# Altium schematic sheet Top.SchDoc: Top
size A4; Date: Not used; ApprovedBy: Not used; CheckedBy: Not used; Author: Not used; CompanyName: STMicroelectronics; DrawnBy: Not used; Engineer: Not used; Organization: Not used; Address1: Not used; Address2: Not used; Address3: Not used; Address4: Not used; DocumentNumber: Not used; Revision: Not used; SheetNumber: 2; SheetTotal: 2; CurrentTime: Not used; CurrentDate: Not used; Time: Not used; DocumentFullPathAndName: Not used; DocumentName: Not used; ModifiedDate: Not used; ImagePath: Not used; ProjectName: Not used; Application_BuildNumber: Not used
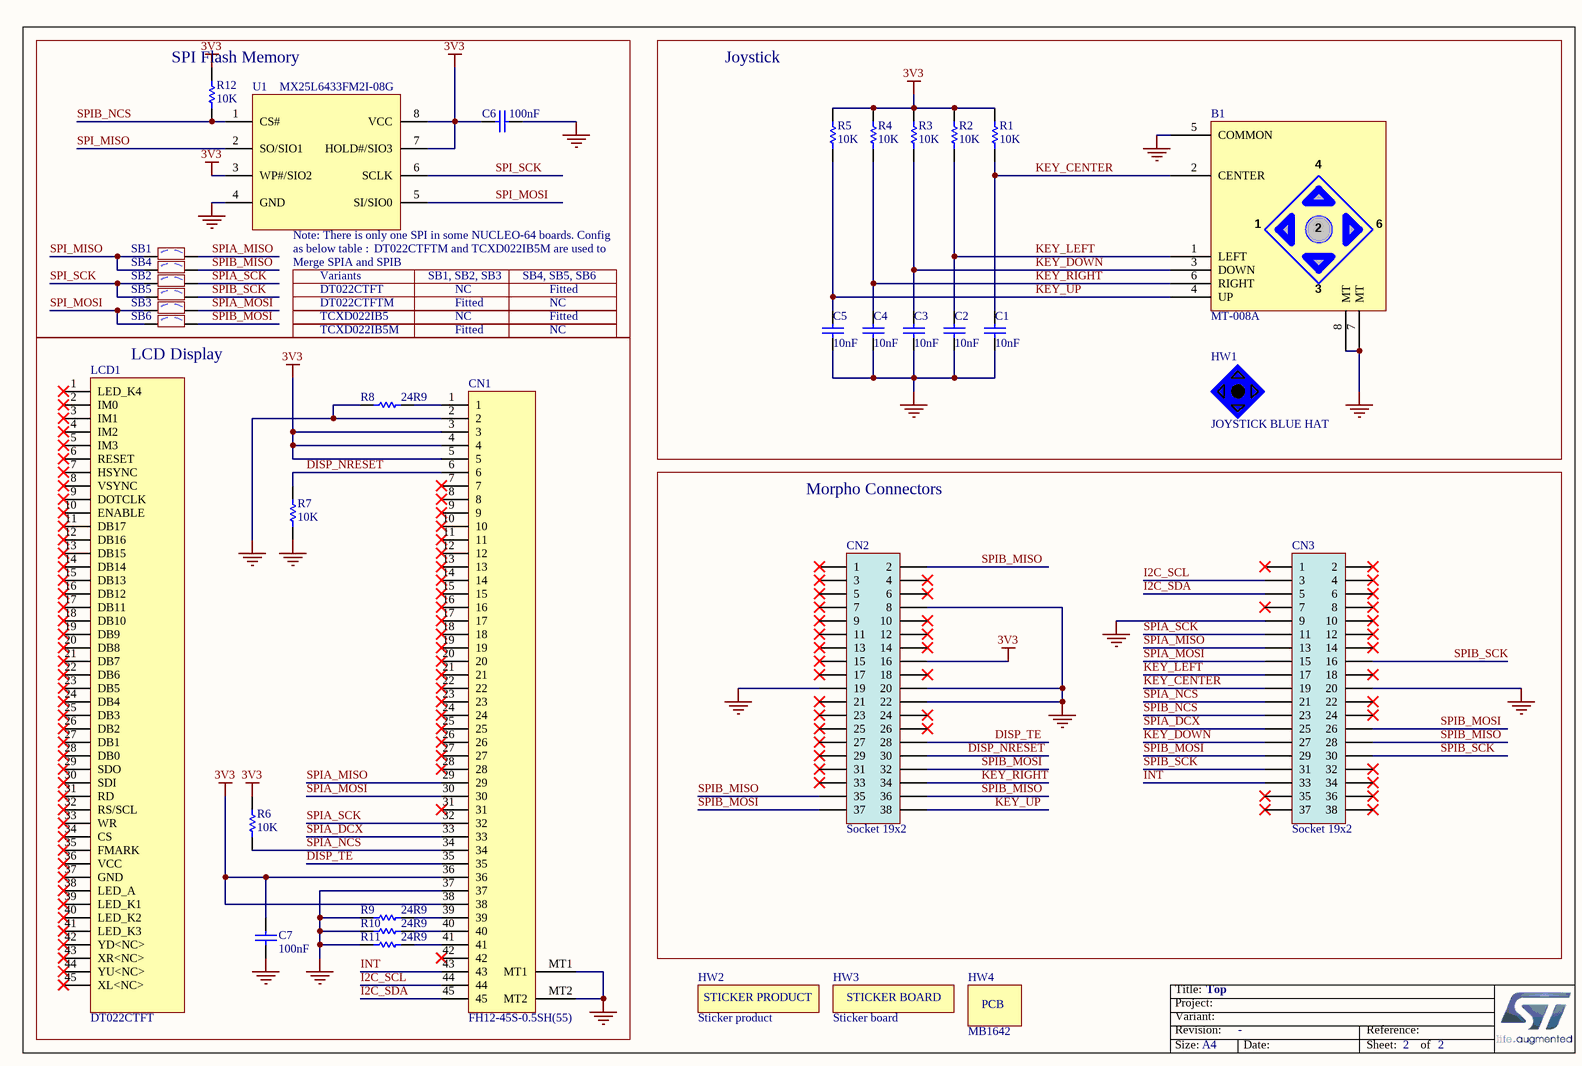
[diagram p0: Top.SchDoc]

## Parts
B1  value MT-008A  [SWI_XIEJIA_MT-008A_6P]  (hidden comment: Joystick MT-008A_M)
C1  value 10nF  [C0603]  (hidden comment: Capacitor)
C2  value 10nF  [C0603]  (hidden comment: Capacitor)
C3  value 10nF  [C0603]  (hidden comment: Capacitor)
C4  value 10nF  [C0603]  (hidden comment: Capacitor)
C5  value 10nF  [C0603]  (hidden comment: Capacitor)
C6  value 100nF  [C0603]  (hidden comment: Capacitor)
C7  value 100nF  [C0603]  (hidden comment: Capacitor)
CN1  FH12-45S-0.5SH(55)  [CON_HRS_FH12-45S-05SH]
CN2  Socket 19x2  [CON_SAMTEC_SSW-119-01-X-D]
CN3  Socket 19x2  [CON_SAMTEC_SSW-119-01-X-D]
HW1  value JOYSTICK BLUE HAT  (hidden comment: JOYSTICK_BLUE_HAT)  (mechanical)
HW2  value Sticker product  [STICKER_PRODUCT_25X5]  (hidden comment: STICKER_PRODUCT)  (no BOM)
HW3  value Sticker board  [STICKER_BOARD_25X5]  (hidden comment: STICKER_BOARD)  (no BOM)
HW4  value MB1642  (hidden comment: PCB)  (no BOM)
LCD1  DT022CTFT  [LCD_DISPLAYTECH_DT022CTFT_45P_P050]
R1  value 10K  [R0603]  (hidden comment: Resistor)
R2  value 10K  [R0603]  (hidden comment: Resistor)
R3  value 10K  [R0603]  (hidden comment: Resistor)
R4  value 10K  [R0603]  (hidden comment: Resistor)
R5  value 10K  [R0603]  (hidden comment: Resistor)
R6  value 10K  [R0603]  (hidden comment: Resistor)
R7  value 10K  [R0603]  (hidden comment: Resistor)
R8  value 24R9  [R1206_H0P55]  (hidden comment: Resistor)
R9  value 24R9  [R1206_H0P55]  (hidden comment: Resistor)
R10  value 24R9  [R1206_H0P55]  (hidden comment: Resistor)
R11  value 24R9  [R1206_H0P55]  (hidden comment: Resistor)
R12  value 10K  [R0603]  (hidden comment: Resistor)
SB1  SB_OFF  [SOLDER-BRIDGE_R0603-0R]  (value not drawn)
SB2  SB_OFF  [SOLDER-BRIDGE_R0603-0R]  (value not drawn)
SB3  SB_OFF  [SOLDER-BRIDGE_R0603-0R]  (value not drawn)
SB4  SB_OFF  [SOLDER-BRIDGE_R0603-0R]  (value not drawn)
SB5  SB_OFF  [SOLDER-BRIDGE_R0603-0R]  (value not drawn)
SB6  SB_OFF  [SOLDER-BRIDGE_R0603-0R]  (value not drawn)
U1  MX25L6433FM2I-08G  [ICC_SOP8_5P23X5P28_P127]

## Blocks framed on the sheet
SPI Flash Memory: C6 R12 SB1-SB6 U1
Joystick: B1 C1-C5 HW1 R1-R5
LCD Display: C7 CN1 LCD1 R6-R11
Morpho Connectors: CN2 CN3

## Nets
3V3: C6.1 C7.2 CN1.3 CN1.4 CN1.5 CN1.36 CN1.38 CN2.16 R1.1 R2.2 R3.2 R4.2 R5.2 R6.2 R12.1 U1.3(WP#/SIO2) U1.7(HOLD#/SIO3) U1.8(VCC)
GND: B1.5(COMMON) B1.7(MT) B1.8(MT) C1.1 C2.1 C3.1 C4.1 C5.1 C6.2 C7.1 CN1.2 CN1.37 CN1.MT1 CN1.MT2 CN2.8 CN2.19 CN2.20 CN2.22 CN3.9 CN3.20 R7.1 R8.1 R9.1 R10.1 R11.1 U1.4(GND)
DISP_NRESET: CN1.6 CN2.30 R7.2
DISP_TE: CN1.35 CN2.28
I2C_SCL: CN1.44 CN3.3
I2C_SDA: CN1.45 CN3.5
INT: CN1.43 CN3.33
KEY_CENTER: B1.2(CENTER) C1.2 CN3.19 R1.2
KEY_DOWN: B1.3(DOWN) C3.2 CN3.27 R3.1
KEY_LEFT: B1.1(LEFT) C2.2 CN3.17 R2.1
KEY_RIGHT: B1.6(RIGHT) C4.2 CN2.34 R4.1
KEY_UP: B1.4(UP) C5.2 CN2.38 R5.1
SPI_MISO: SB1.1 SB4.1 U1.2(SO/SIO1)
SPI_MOSI: SB3.1 SB6.1 U1.5(SI/SIO0)
SPI_SCK: SB2.1 SB5.1 U1.6(SCLK)
SPIA_DCX: CN1.33 CN3.25
SPIA_MISO: CN1.29 CN3.13 SB1.2
SPIA_MOSI: CN1.30 CN3.15 SB3.2
SPIA_NCS: CN1.34 CN3.21 R6.1
SPIA_SCK: CN1.32 CN3.11 SB2.2
SPIB_MISO: CN2.2 CN2.35 CN2.36 CN3.28 SB4.2
SPIB_MOSI: CN2.32 CN2.37 CN3.26 CN3.29 SB6.2
SPIB_NCS: CN3.23 R12.2 U1.1(CS#)
SPIB_SCK: CN3.16 CN3.30 CN3.31 SB5.2
NetCN1_1: CN1.1 R8.2
NetCN1_39: CN1.39 R9.2
NetCN1_40: CN1.40 R10.2
NetCN1_41: CN1.41 R11.2

Not connected (* = marked no-connect by the designer): CN1 7* 8* 9* 10* 11* 12* 13* 14* 15* 16* 17* 18* 19* 20* 21* 22* 23* 24* 25* 26* 27* 28* 31* 42*; CN2 1* 3* 4* 5* 6* 7* 9* 10* 11* 12* 13* 14* 15* 17* 18* 21* 23* 24* 25* 26* 27* 29* 31* 33*; CN3 1* 2* 4* 6* 7* 8* 10* 12* 14* 18* 22* 24* 32* 34* 35* 36* 37* 38*; LCD1 1(LED_K4)* 2(IM0)* 3(IM1)* 4(IM2)* 5(IM3)* 6(RESET)* 7(HSYNC)* 8(VSYNC)* 9(DOTCLK)* 10(ENABLE)* 11(DB17)* 12(DB16)* 13(DB15)* 14(DB14)* 15(DB13)* 16(DB12)* 17(DB11)* 18(DB10)* 19(DB9)* 20(DB8)* 21(DB7)* 22(DB6)* 23(DB5)* 24(DB4)* 25(DB3)* 26(DB2)* 27(DB1)* 28(DB0)* 29(SDO)* 30(SDI)* 31(RD)* 32(RS/SCL)* 33(WR)* 34(CS)* 35(FMARK)* 36(VCC)* 37(GND)* 38(LED_A)* 39(LED_K1)* 40(LED_K2)* 41(LED_K3)* 42(YD<NC>)* 43(XR<NC>)* 44(YU<NC>)* 45(XL<NC>)*

## Notes on the sheet
- (near U1) Note: There is only one SPI in some NUCLEO-64 boards. Config
- (near U1) as below table :
- Merge SPIA and SPIB
- (near U1) DT022CTFTM and TCXD022IB5M are used to
- DT022CTFTM
- DT022CTFT
- Variants
- TCXD022IB5
- TCXD022IB5M
- SB1, SB2, SB3
- NC
- Fitted
- SB4, SB5, SB6
- Title:
- Project:
- Size:
- Revision:
- Variant:
- A4
- -
- Date:
- Reference:
- Sheet:
- of
- (in symbol MCD-02189) STICKER PRODUCT
- (in symbol MCD-02190) STICKER BOARD

## Library data of the parts
B1 = MCD-00132: Joystick, 4 dir, 1 OK; Part_Type: Misc; Manufacturer: XIEJIA ELECTRONICS; BMS_Part_Number: 9180124; Provided_By: SUBCO; Internal_Part_Number: MCD-00132; Status: Released; Manufacturer_Part_Number: MT-008A; ComponentLink1Description: Datasheet; ComponentLink1URL: http://tunmcdsvn.tun.st.com/Component_Datasheet_Library/Trunk/Misc/Xieja electronics_MT-008A; ECCN_US: n/a; ECCN_EU: n/a
C1-C5 = MCD-01098: Capacitor,10nF,100V,X7R,10%,0603; Manufacturer_Part_Number: CC0603KRX7R0BB103; Manufacturer: YAGEO; ECCN_US: EAR99; ECCN_EU: NEC; Provided_By: SUBCO; Internal_Part_Number: MCD-01098; Status: Checked; Part_Type: Capacitor; Alternate_Manufacturer_Part_Number: N/A; Alternate_Manufacturer: N/A; Package: C0603; ComponentLink1Description: Datasheet; ComponentLink1URL: http://tunmcdsvn.tun.st.com/Component_Datasheet_Library/Trunk/Capacitors/Yageo_Multilayer_Capacitor_NPO_X7R_100V_to_630V_0.47pF%20to%202.2uF/Yageo_Multilayer_Capacitor_NPO_X7R_100V_to_630V_0.47pF%20to%202.2uF.pdf; Order_Code_Digikey: 311-1788-1-ND; Order_Code_Farnell: 1284119; Order_Code_RS: N/A; BMS_Part_Number: N/A
C6 C7 = MCD-00211: Capacitor, MLCC, 100nF, 16V, X7R, +/-10%, 0603, T=0,8mm; Part_Preference: Recommended; Manufacturer: YAGEO; Manufacturer_Part_Number: CC0603KRX7R7BB104; Order_Code_RS: 669-8763; Internal_Part_Number: MCD-00211; Status: Released; Part_Type: Capacitor; Package: C0603; ComponentLink1URL: http://tunmcdsvn.tun.st.com/Component_Datasheet_Library/Trunk/Capacitors/Yageo_Multilayer_Capacitor_X7R_series_100pF_to_22uF; Order_Code_Digikey: 311-1088-1-ND; Order_Code_Farnell: 432210
CN1 = MCD-01980: 45 pins P 0.5 surface mount connector; Manufacturer: HIROSE; Order_Code_RS: 772-7027; ECCN_US: EAR99; ECCN_EU: NEC; Provided_By: SUBCO; Internal_Part_Number: MCD-01980; Status: Checked; Part_Type: Connector; Manufacturer_Part_Number: FH12-45S-0.5SH(55); Alternate_Manufacturer_Part_Number: N/A; Alternate_Manufacturer: N/A; ComponentLink1Description: Datasheet; ComponentLink1URL: http://tunmcdsvn.tun.st.com/Component_Datasheet_Library/Trunk/Connectors/Hirose_FH12-45S-05SH/Hirose_FH12-45S-0.5SH(55).pdf; Order_Code_Digikey: HFJ145CT-ND; Order_Code_Farnell: 2427723; BMS_Part_Number: N/A
CN2 CN3 = MCD-01845: Socket, 19x2, 2.54mm, VR, TH, Height 8.51mm/2.64mm; Part_Type: Connector; Manufacturer_Part_Number: SSW-119-01-x-D; Manufacturer: SAMTEC; Provided_By: SUBCO; Internal_Part_Number: MCD-01845; Value: Socket 19x2; Status: Checked; ComponentLink1Description: Datasheet; ComponentLink1URL: http://tunmcdsvn.tun.st.com/Component_Datasheet_Library/Trunk/Connectors/Samtec_SSW-SSQ-series; ECCN_US: n/a; ECCN_EU: n/a
HW1 = MCD-01337: Joystick Blue Hat; Part_Type: Mechanical; Manufacturer_Part_Number: PB-504; Manufacturer: JIUBABA; Provided_By: SUBCO; Internal_Part_Number: MCD-01337; Status: Released; ComponentLink1Description: Datasheet; ComponentLink1URL: http://tunmcdsvn.tun.st.com/Component_Datasheet_Library/Trunk/Mechanical/JIUBABA_JOYSTICK_HAT_PB-504; ECCN_US: n/a; ECCN_EU: n/a
HW2 = MCD-02189: Sticker product 25x5 mm; Part_Type: Misc; Part_Preference: Recommended; Internal_Part_Number: MCD-02189; Status: Released; Manufacturer: N/A; Manufacturer_Part_Number: N/A; Alternate_Manufacturer: N/A; Alternate_Manufacturer_Part_Number: N/A; Package: N/A; ComponentLink1URL: N/A; Order_Code_Digikey: N/A; Order_Code_Farnell: N/A; Order_Code_RS: N/A
HW3 = MCD-02190: Sticker board 25x5 mm; Part_Type: Misc; Part_Preference: Recommended; Internal_Part_Number: MCD-02190; Status: Released; Manufacturer: N/A; Manufacturer_Part_Number: N/A; Alternate_Manufacturer: N/A; Alternate_Manufacturer_Part_Number: N/A; Package: N/A; ComponentLink1URL: N/A; Order_Code_Digikey: N/A; Order_Code_Farnell: N/A; Order_Code_RS: N/A
HW4 = MCD-02495: MB1642 PCB; Part_Preference: Recommended; Internal_Part_Number: MCD-02495; Status: Checked; Part_Type: PCB; Manufacturer: N/A; Manufacturer_Part_Number: N/A; Alternate_Manufacturer: N/A; Alternate_Manufacturer_Part_Number: N/A; ComponentLink1URL: http://tunmcdsvn.tun.st.com/Component_Documentation_Library/Trunk/PCB/MB1642; Order_Code_Digikey: N/A; Order_Code_Farnell: N/A; Order_Code_RS: N/A
LCD1 = MCD-01982: 240x320 2.2inch display; Manufacturer: DISPLAYTECH; Order_Code_RS: 182-5796; ECCN_US: EAR99; ECCN_EU: NEC; Provided_By: SUBCO; Internal_Part_Number: MCD-01982; Status: Checked; Part_Type: Display; Manufacturer_Part_Number: DT022CTFT; ComponentLink1Description: Datasheet; ComponentLink1URL: http://tunmcdsvn.tun.st.com/Component_Datasheet_Library/Trunk/Display/Displaytech_LCD_DT022CTFT/DisplayTech_2.2_240x320.pdf
R1-R7 R12 = MCD-00220: Resistor,10K,0603,1%,1/10W; Manufacturer_Part_Number: RC0603FR-0710KL; Manufacturer: YAGEO; ECCN_US: EAR99; ECCN_EU: NEC; Provided_By: SUBCO; Internal_Part_Number: MCD-00220; Status: Released; Part_Type: Resistor; Package: R0603; ComponentLink1Description: Datasheet; ComponentLink1URL: http://tunmcdsvn.tun.st.com/Component_Datasheet_Library/Trunk/Resistors/Yageo_Resistor_RC0603-series
R8-R11 = MCD-02611: Resistor, 24R9, 1206, +/-1%, 1/4W; Manufacturer_Part_Number: RC1206FR-0724R9L; Manufacturer: YAGEO; Part_Preference: Recommended; Internal_Part_Number: MCD-02611; Status: Checked; Part_Type: Resistor; Package: 1206; ComponentLink1URL: http://tunmcdsvn.tun.st.com/Component_Documentation_Library/Trunk/Resistor/YAGEO_RC_L_Series/; Order_Code_Digikey: 311-24.9FRTR-ND; Order_Code_Farnell: 3496190RL; Order_Code_RS: N/A
SB1-SB6 = MCD-00072: Solder Bridge OFF; Part_Type: Misc; Part_Preference: Recommended; Manufacturer: YAGEO; Manufacturer_Part_Number: RC0603JR-070RL; Internal_Part_Number: MCD-00072; Status: Released; Package: SB0603; ComponentLink1URL: http://tunmcdsvn.tun.st.com/Component_Datasheet_Library/Trunk/Resistors/Yageo_Resistor_RC0603-series
U1 = MCD-01981: Part_Type: IC; Manufacturer: MACRONIX; Order_Code_RS: 170-3096; ECCN_US: 3A991.B.1.A; ECCN_EU: NEC; Provided_By: SUBCO; Internal_Part_Number: MCD-01981; Status: Checked; Manufacturer_Part_Number: MX25L6433FM2I-08G; Alternate_Manufacturer_Part_Number: N/A; Alternate_Manufacturer: N/A; Package: SOP8 200; ComponentLink1Description: Datasheet; ComponentLink1URL: http://tunmcdsvn.tun.st.com/Component_Datasheet_Library/Trunk/IC/Macronix_NOR_QSPI_MX25L6433F/; Order_Code_Digikey: MX25L6433FM2I-08G-ND; Order_Code_Farnell: 3129181; BMS_Part_Number: N/A